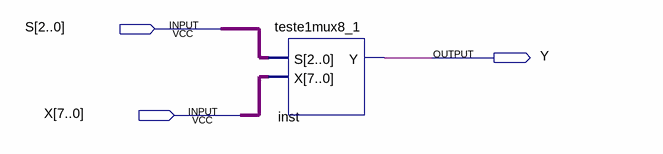
[diagram p0: schematic sheet]
// Quartus schematic teste1symbol.bdf as structural Verilog: 1 symbols, 3 pins
module teste1symbol (
  input  [2:0] S,
  input  [7:0] X,
  output Y
);

  teste1mux8_1 inst (.S(S), .X(X), .Y(Y));
endmodule
